# Altium schematic sheet Top_Level.SchDoc
size A4; SheetNumber: 1; SheetTotal: 3
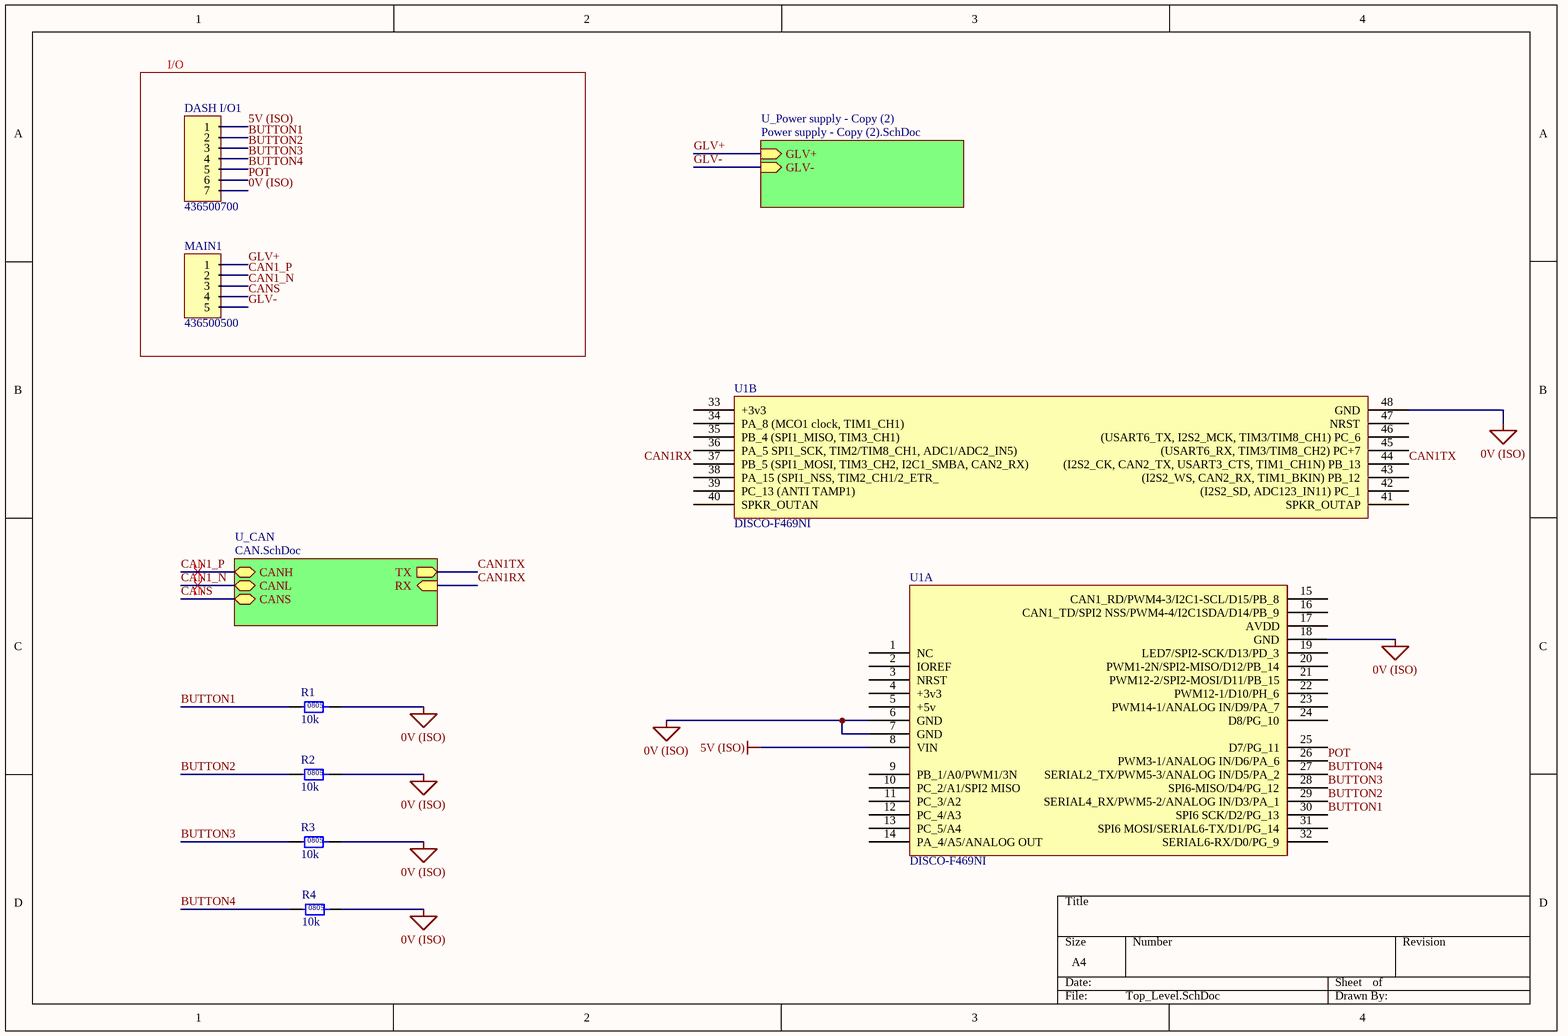
[diagram p0: Top_Level.SchDoc]

## Parts
DASH_I/O1  436500700  [436500700]
MAIN1  436500500  [436500500]
R1  10k  [0805]
R2  10k  [0805]
R3  10k  [0805]
R4  10k  [0805]
U1  DISCO-F469NI  [DISCO-F469NI]  (parts A,B of 2)

## Blocks framed on the sheet
I/O: DASH_I/O1 MAIN1

## Sub-sheets
U_CAN = CAN.SchDoc: CANH (bidir), CANL (bidir), CANS (bidir), RX (in), TX (out)
U_Power supply - Copy (2) = Power supply - Copy (2).SchDoc: GLV+ (in), GLV- (in)

## Nets
0V (ISO): DASH_I/O1.7 R1.2 R2.2 R3.2 R4.2 U1.6(GND) U1.7(GND) U1.18(GND) U1.48(GND)
5V (ISO): DASH_I/O1.1 U1.8(VIN)
BUTTON1: DASH_I/O1.2 R1.1 U1.30(SPI6_SCK/D2/PG_13)
BUTTON2: DASH_I/O1.3 R2.1 U1.29(SERIAL4_RX/PWM5-2/ANALOG_IN/D3/PA_1)
BUTTON3: DASH_I/O1.4 R3.1 U1.28(SPI6-MISO/D4/PG_12)
BUTTON4: DASH_I/O1.5 R4.1 U1.27(SERIAL2_TX/PWM5-3/ANALOG_IN/D5/PA_2)
CAN1_N: MAIN1.3 ; sheet U_CAN/CANL
CAN1_P: MAIN1.2 ; sheet U_CAN/CANH
CAN1RX: U1.37(PB_5_(SPI1_MOSI,_TIM3_CH2,_I2C1_SMBA,_CAN2_RX)) ; sheet U_CAN/RX
CAN1TX: U1.44((I2S2_CK,_CAN2_TX,_USART3_CTS,_TIM1_CH1N)_PB_13) ; sheet U_CAN/TX
CANS: MAIN1.4 ; sheet U_CAN/CANS
GLV+: MAIN1.1 ; sheet U_Power supply - Copy (2)/GLV+
GLV-: MAIN1.5 ; sheet U_Power supply - Copy (2)/GLV-
POT: DASH_I/O1.6 U1.26(PWM3-1/ANALOG_IN/D6/PA_6)

Not connected (* = marked no-connect by the designer): U1 1(NC) 2(IOREF) 3(NRST) 4(+3v3) 5(+5v) 9(PB_1/A0/PWM1/3N) 10(PC_2/A1/SPI2_MISO) 11(PC_3/A2) 12(PC_4/A3) 13(PC_5/A4) 14(PA_4/A5/ANALOG_OUT) 15(CAN1_RD/PWM4-3/I2C1-SCL/D15/PB_8) 16(CAN1_TD/SPI2_NSS/PWM4-4/I2C1SDA/D14/PB_9) 17(AVDD) 19(LED7/SPI2-SCK/D13/PD_3) 20(PWM1-2N/SPI2-MISO/D12/PB_14) 21(PWM12-2/SPI2-MOSI/D11/PB_15) 22(PWM12-1/D10/PH_6) 23(PWM14-1/ANALOG_IN/D9/PA_7) 24(D8/PG_10) 25(D7/PG_11) 31(SPI6_MOSI/SERIAL6-TX/D1/PG_14) 32(SERIAL6-RX/D0/PG_9) 33(+3v3) 34(PA_8_(MCO1_clock,_TIM1_CH1)) 35(PB_4_(SPI1_MISO,_TIM3_CH1)) 36(PA_5_SPI1_SCK,_TIM2/TIM8_CH1,_ADC1/ADC2_IN5)) 38(PA_15_(SPI1_NSS,_TIM2_CH1/2_ETR_) 39(PC_13_(ANTI_TAMP1)) 40(SPKR_OUTAN) 41(SPKR_OUTAP) 42((I2S2_SD,_ADC123_IN11)_PC_1) 43((I2S2_WS,_CAN2_RX,_TIM1_BKIN)_PB_12) 45((USART6_RX,_TIM3/TIM8_CH2)_PC+7) 46((USART6_TX,_I2S2_MCK,_TIM3/TIM8_CH1)_PC_6) 47(NRST)

## Layout directives
differential pair: CAN1_N, CAN1_P

## Notes on the sheet
- (in symbol RC0805FR0710KL) 0805

## Library data of the parts
DASH_I/O1 = 436500700: Micro-Fit 7x1; Positions: 7; Pitch: 3.0mm; Angle: 90; Flange: No; Contact: Tin; Part Number: 436500700; Row Spacing: 3.0mm; Digikey Part Number: WM2423-ND; Digikey Link: https://www.digikey.com.au/en/products/detail/molex/0436500700/531339
MAIN1 = 436500500: Micro-Fit 5x1; Positions: 5; Pitch: 3.0mm; Angle: 90; Flange: No; Contact: Tin; Part Number: 436500500; Row Spacing: 3.0mm; Digikey Part Number: WM1863-ND; Digikey Link: https://www.digikey.com.au/en/products/detail/molex/0436500500/268992
R1-R4 = RC0805FR0710KL: Manufacturer: YAGEO; Tolerance: 0.01; Rated Power: 0.125W; Part Number: RC0805FR0710KL; Value: 10k; Material: FR-07; Digikey Part Number: 311-10.0KCRCT-ND
U1 = DISCO-F469NI: STM32F469 Discovery STM32F4 ARM® Cortex®-M4 MCU 32-Bit Embedded Evaluation Board  (The Disco 69 lol); Manufacturer: STMicroelectronics; Part Number: DISCO-F469NI; Digikey Part Number: 497-15990-ND; Digikey Link: https://www.digikey.com/product-detail/en/stmicroelectronics/STM32F469I-DISCO/497-15990-ND/5428811